# Altium project SkateInfoView.PrjPcb
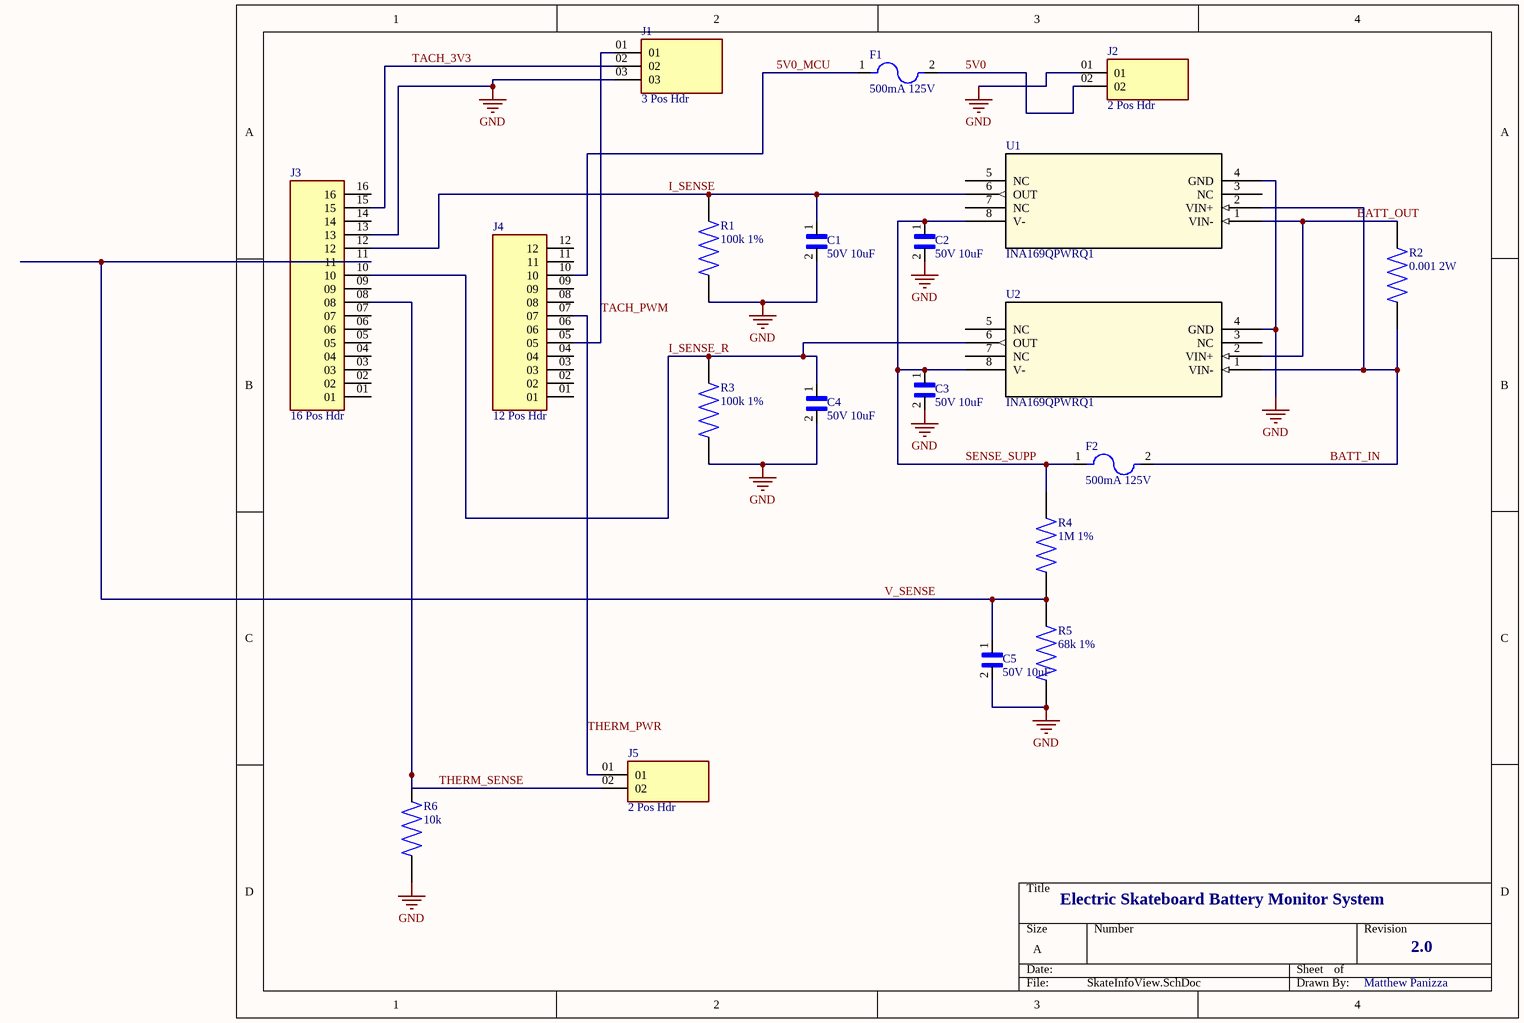
[diagram p0: SkateInfoView.SchDoc]
1 sheet, 20 parts. Net scope: global (net labels, ports and power ports of the same name join across sheets).
Board file: SkateInfoView.PcbDoc

## Sheet SkateInfoView.SchDoc
size A; SheetNumber: 1; SheetTotal: 1

### Parts
C1  50V 10uF  [CAP3216X125N]
C2  50V 10uF  [CAP3216X125N]
C3  50V 10uF  [CAP3216X125N]
C4  50V 10uF  [CAP3216X125N]
C5  50V 10uF  [CAP3216X125N]
F1  500mA 125V  [FUSC3215X78N]
F2  500mA 125V  [FUSC3215X78N]
J1  3 Pos Hdr  [SAMTEC_SSQ-103-02-T-S-RA]
J2  2 Pos Hdr  [SAMTEC_SSQ-102-02-T-S-RA]
J3  16 Pos Hdr  [SAMTEC_SSW-116-XX-X-S]
J4  12 Pos Hdr  [SAMTEC_SSW-112-01-X-S]
J5  2 Pos Hdr  [SAMTEC_SSQ-102-02-T-S-RA]
R1  100k 1%  [RESC2012X65N]
R2  0.001 2W  [RESC6432X90N]
R3  100k 1%  [RESC2012X65N]
R4  1M 1%  [RESC3115X65N]
R5  68k 1%  [RESC3115X65N]
R6  10k  [RESC2012X65N]
U1  INA169QPWRQ1  [PW8]
U2  INA169QPWRQ1  [PW8]

### Nets
GND: C1.2 C2.2 C3.2 C4.2 C5.2 J1.03 J2.01 J3.13 R1.1 R3.1 R5.1 R6.1 U1.4(GND) U2.4(GND)
5V0: F1.2 J2.02
5V0_MCU: F1.1 J4.10
BATT_IN: F2.2 R2.1 U1.2(VIN+) U2.1(VIN-)
BATT_OUT: R2.2 U1.1(VIN-) U2.2(VIN+)
I_SENSE: C1.1 J3.12 R1.2 U1.6(OUT)
I_SENSE_R: C4.1 J3.10 R3.2 U2.6(OUT)
SENSE_SUPP: C2.1 C3.1 F2.1 R4.2 U1.8(V-) U2.8(V-)
TACH_3V3: J1.02 J3.15
TACH_PWM: J1.01 J4.05
THERM_PWR: J4.07 J5.01
THERM_SENSE: J3.08 J5.02 R6.2
V_SENSE: C5.1 J3.11 R4.1 R5.2

Not connected (* = marked no-connect by the designer): J3 01 02 03 04 05 06 07 09 14 16; J4 01 02 03 04 06 08 09 11 12; U1 3(NC) 5(NC) 7(NC); U2 3(NC) 5(NC) 7(NC)

### Notes on the sheet
- Electric Skateboard Battery Monitor System
- 2.0
- Matthew Panizza

### Library data of the parts
C1-C5 = GRT31CR61H106ME01L: 1206 10 uF 50 V Â±20% Tolerance X5R Multilayer Ceramic Capacitor; MF: {'manufacturer': u'Murata Electronics'}; MP: GRT31CR61H106ME01L; Price: None; Package: None; Availability: Unavailable; Value: *
F1 F2 = C1Q-500: MF: {'manufacturer': u'Bel Fuse'}; MP: C1Q-500; Price: None; Package: None; Availability: Unavailable; Value: *
J1 = SSQ-103-02-T-S-RA: MF: {'manufacturer': u'Samtec'}; MP: SSQ-103-02-T-S-RA; Price: None; Package: None; Availability: Unavailable; Value: *
J2 J5 = SSQ-102-02-T-S-RA: MF: {'manufacturer': u'Samtec'}; MP: SSQ-102-02-T-S-RA; Price: None; Package: None; Availability: Unavailable; Value: *
J3 = SSW-116-XX-X-S: MF: {'manufacturer': u'Samtec'}; MP: SSW-116-XX-X-S; Value: *; Package: None; Price: None; Availability: Unavailable
J4 = SSW-112-01-X-S: CONN RCPT 12POS 0.1 GOLD PCB; MF: {'manufacturer': u'Samtec'}; MP: SSW-112-01-X-S; Price: None; Package: None; Availability: Unavailable; Value: *
R1 R3 = CRG0805F100K: CRG0805 1% 100K; MF: {'manufacturer': u'TE Connectivity'}; MP: CRG0805F100K; Price: None; Package: None; Availability: Unavailable; Value: *
R2 = CRE2512-FZ-R001E-3: MF: {'manufacturer': u'Bourns Inc.'}; MP: CRE2512-FZ-R001E-3; Price: None; Package: None; Availability: Unavailable; Value: *
R4 = CRG1206F1M0: CRG1206 1% 1M0; MF: {'manufacturer': u'TE Connectivity'}; MP: CRG1206F1M0; Price: None; Package: None; Availability: Unavailable; Value: *
R5 = CRGCQ1206F68K: Fixed Resistor CRGCQ 1206 68K 1%; MF: {'manufacturer': u'TE Connectivity'}; MP: CRGCQ1206F68K; Price: None; Package: None; Availability: Unavailable; Value: *
R6 = CRGCQ0805J10K: Fixed Resistor CRGCQ 0805 10K 5%; MF: {'manufacturer': u'TE Connectivity'}; MP: CRGCQ0805J10K; Price: None; Package: None; Availability: Unavailable; Value: *
U1 U2 = INA169QPWRQ1: No Description Available; Mfr_Name: Texas Instruments; Copyright: Copyright (C) 2021 Ultra Librarian. All rights reserved.; Manufacturer_Part_Number: INA169QPWRQ1; RefDes: RefDes; Type: DEV